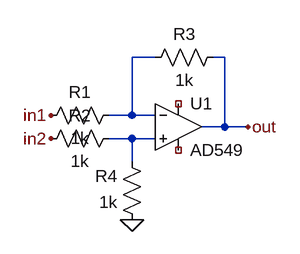
[diagram p0: schematic Subtraction.asc]
Subtraction.asc, the LTspice schematic file:
Version 4
SHEET 1 880 680
WIRE 256 96 224 96
WIRE 352 96 336 96
WIRE 224 176 224 96
WIRE 224 176 192 176
WIRE 256 176 224 176
WIRE 352 192 352 96
WIRE 352 192 320 192
WIRE 384 192 352 192
WIRE 224 208 192 208
WIRE 256 208 224 208
WIRE 224 240 224 208
FLAG 224 320 0
FLAG 112 176 in1
FLAG 112 208 in2
FLAG 384 192 out
SYMBOL Opamps\\AD549 288 128 R0
SYMATTR InstName U1
SYMBOL res 208 160 R90
WINDOW 0 0 56 VBottom 2
WINDOW 3 32 56 VTop 2
SYMATTR InstName R1
SYMATTR Value 1k
SYMBOL res 208 192 R90
WINDOW 0 0 56 VBottom 2
WINDOW 3 32 56 VTop 2
SYMATTR InstName R2
SYMATTR Value 1k
SYMBOL res 352 80 R90
WINDOW 0 0 56 VBottom 2
WINDOW 3 32 56 VTop 2
SYMATTR InstName R3
SYMATTR Value 1k
SYMBOL res 240 336 R180
WINDOW 0 36 76 Left 2
WINDOW 3 36 40 Left 2
SYMATTR InstName R4
SYMATTR Value 1k

The netlist it stands for:
* Subtraction.asc
XU1 N002 N001 NC_01 NC_02 out AD549  ; pins In+ In- V+ V- OUT
R1 N001 in1 1k
R2 N002 in2 1k
R3 out N001 1k
R4 0 N002 1k
.backanno
.end